# Altium project DST800_NMEA2k-CAN_Indicator.PrjPcb
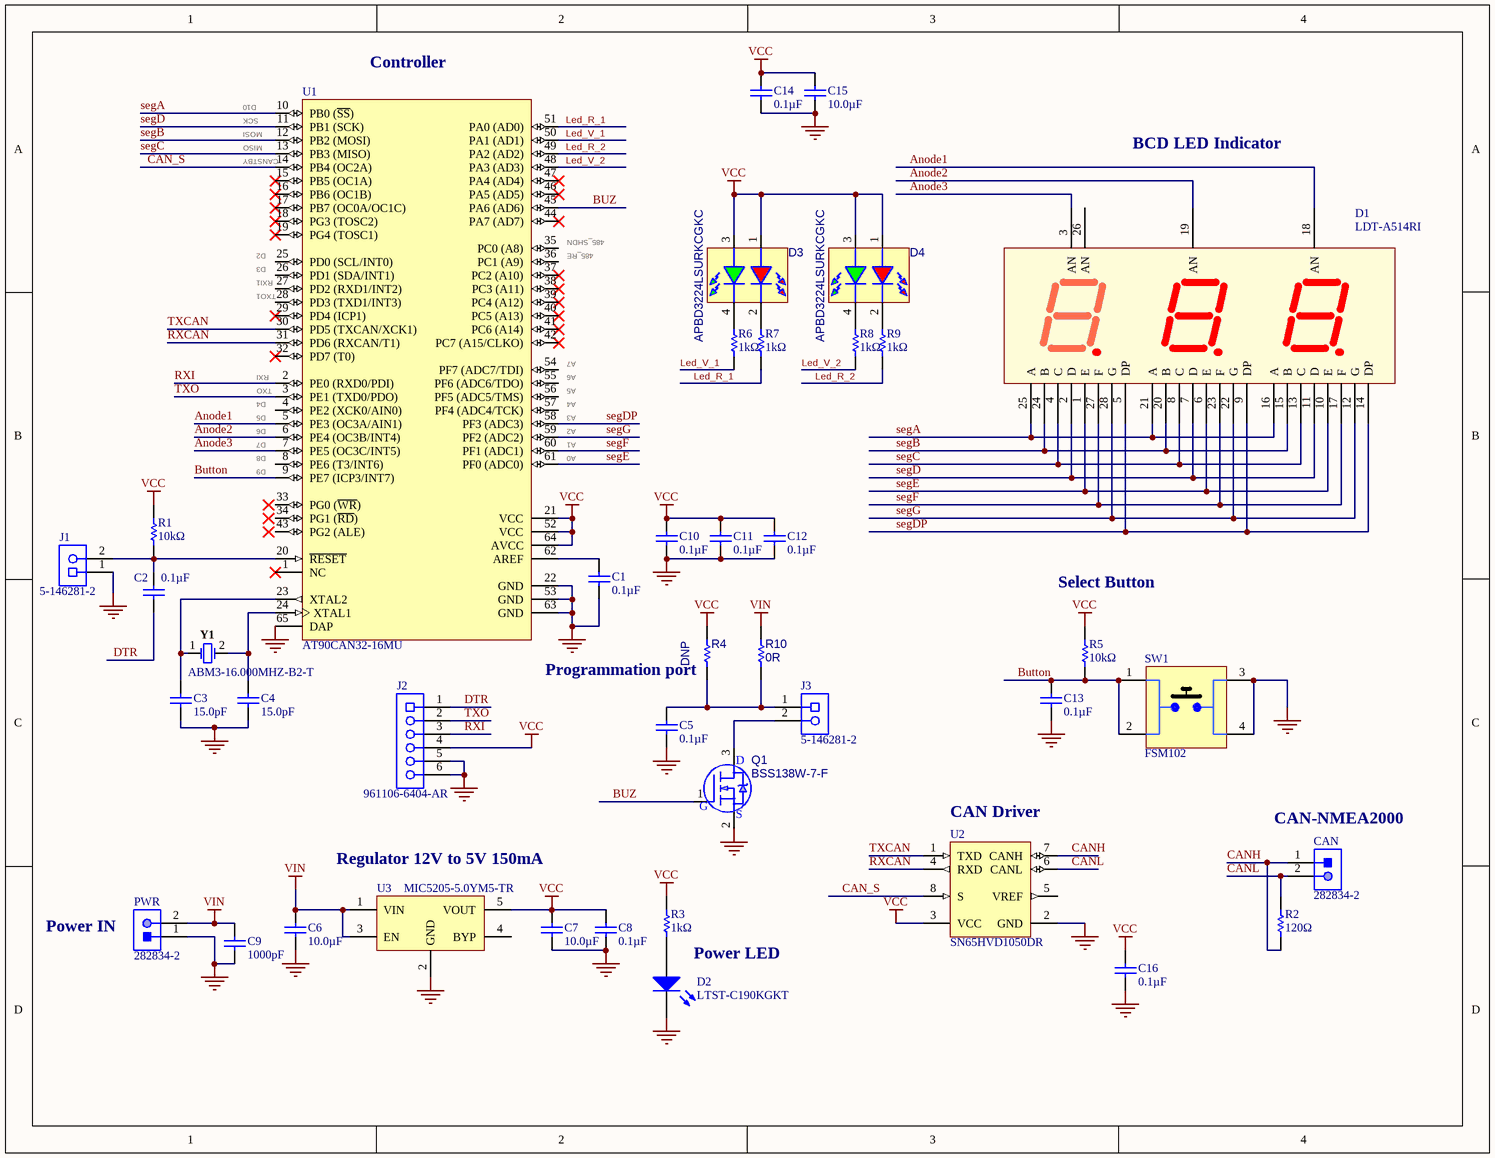
[diagram p0: DST800_NMEA2k-CAN_Indicator.SchDoc]
1 sheet, 41 parts. Net scope: global (net labels, ports and power ports of the same name join across sheets).
Board file: DST800_NMEA2k-CAN_Indicator.PcbDoc

## Sheet DST800_NMEA2k-CAN_Indicator.SchDoc: TITRE
size Letter; ApprovedBy: Approuvé par; CompanyName: Cégep de Limoilou; DrawnBy: Dessiné par; Organization: Cégep de Limoilou; DocumentNumber: Numéro schéma; Revision: Prel; SheetNumber: 1; SheetTotal: 1; CurrentDate: .date

### Parts
C1  value 0.1µF  [PCB-mhhqftc5ilnrg4qi8ds6-1]  (hidden comment: CL10B104KB8NNNC)
C2  value 0.1µF  [PCB-mhhqftc5ilnrg4qi8ds6-1]  (hidden comment: CL10B104KB8NNNC)
C3  value 15.0pF  [PCB-69ec8bfnjhyebnpbrrfx-1]  (hidden comment: C1608C0G1H150J080AA)
C4  value 15.0pF  [PCB-69ec8bfnjhyebnpbrrfx-1]  (hidden comment: C1608C0G1H150J080AA)
C5  value 0.1µF  [PCB-mhhqftc5ilnrg4qi8ds6-1]  (hidden comment: CL10B104KB8NNNC)
C6  value 10.0µF  [PCB-j0jk5xr8qbnaskonccg4-1]  (hidden comment: C3225X7R1E106K250AC)
C7  value 10.0µF  [PCB-j0jk5xr8qbnaskonccg4-1]  (hidden comment: C3225X7R1E106K250AC)
C8  value 0.1µF  [PCB-mhhqftc5ilnrg4qi8ds6-1]  (hidden comment: CL10B104KB8NNNC)
C9  value 1000pF  [CAPC1608X90X35LL15T15]  (hidden comment: 06031C102MAT2A)
C10  value 0.1µF  [PCB-mhhqftc5ilnrg4qi8ds6-1]  (hidden comment: CL10B104KB8NNNC)
C11  value 0.1µF  [PCB-mhhqftc5ilnrg4qi8ds6-1]  (hidden comment: CL10B104KB8NNNC)
C12  value 0.1µF  [PCB-mhhqftc5ilnrg4qi8ds6-1]  (hidden comment: CL10B104KB8NNNC)
C13  value 0.1µF  [PCB-mhhqftc5ilnrg4qi8ds6-1]  (hidden comment: CL10B104KB8NNNC)
C14  value 0.1µF  [PCB-mhhqftc5ilnrg4qi8ds6-1]  (hidden comment: CL10B104KB8NNNC)
C15  value 10.0µF  [PCB-j0jk5xr8qbnaskonccg4-1]  (hidden comment: C3225X7R1E106K250AC)
C16  value 0.1µF  [PCB-mhhqftc5ilnrg4qi8ds6-1]  (hidden comment: CL10B104KB8NNNC)
CAN  282834-2  [PCB-0kdx5sneyudsmu18l6zv-1]
D1  LDT-A514RI  [LDTA514RI]
D2  LTST-C190KGKT  [PCB-eapfwhp0rnksgujf96h3-1]
D3  APBD3224LSURKCGKC  [DS_LED_3224]
D4  APBD3224LSURKCGKC  [DS_LED_3224]
J1  5-146281-2  [PCB-angfy19quc8nc8nc7d0m-1]
J2  961106-6404-AR  [PCB-660833-1]
J3  5-146281-2  [PCB-angfy19quc8nc8nc7d0m-1]
PWR  282834-2  [PCB-0kdx5sneyudsmu18l6zv-1]
Q1  BSS138W-7-F  [SOT323-3N]
R1  value 10kΩ  [RESC1608X55X30NL15T15]  (hidden comment: CRG0603F10K)
R2  value 120Ω  [RESC3216X60X45LL10T20]  (hidden comment: CRCW1206120RJNEA)
R3  value 1kΩ  [RESC1608X55X30NL20T20]  (hidden comment: ERA-3AEB102V)
R4  DNP  [R_1005[0402]]  (no BOM)
R5  value 10kΩ  [RESC1608X55X30NL15T15]  (hidden comment: CRG0603F10K)
R6  value 1kΩ  [RESC1608X55X30NL20T20]  (hidden comment: ERA-3AEB102V)
R7  value 1kΩ  [RESC1608X55X30NL20T20]  (hidden comment: ERA-3AEB102V)
R8  value 1kΩ  [RESC1608X55X30NL20T20]  (hidden comment: ERA-3AEB102V)
R9  value 1kΩ  [RESC1608X55X30NL20T20]  (hidden comment: ERA-3AEB102V)
R10  value 0R  [R_1005[0402]]  (hidden comment: CRCW04020000Z0ED)
SW1  FSM102  [PCB-8ps4wla3pj92cxv2yuvu-1]
U1  AT90CAN32-16MU  [Z64-1_M]
U2  SN65HVD1050DR  [D0008A_L]
U3  MIC5205-5.0YM5-TR  [SOT-23-5_N]
Y1  ABM3-16.000MHZ-B2-T  [ABRA-ABM3_V]

### Nets
GND: C1.1 C3.1 C4.1 C5.1 C6.1 C7.1 C8.1 C9.1 C10.1 C11.1 C12.1 C13.1 C14.1 C15.1 C16.1 D2.2(K) J1.1 J2.5 J2.6 PWR.1 Q1.2(S) SW1.3 SW1.4 U1.22(GND) U1.53(GND) U1.63(GND) U1.65(DAP) U2.2(GND) U3.2(GND)
VCC: C7.2 C8.2 C10.2 C11.2 C12.2 C14.2 C15.2 C16.2 D3.1 D3.3 D4.1 D4.3 J2.4 R1.2 R3.2 R4.2 R5.2 U1.21(VCC) U1.52(VCC) U1.64(AVCC) U2.3(VCC) U3.5(VOUT)
VIN: C6.2 C9.2 PWR.2 R10.2 U3.1(VIN) U3.3(EN)
Anode1: D1.18(AN) U1.5(PE3_(OC3A/AIN1))
Anode2: D1.19(AN) U1.6(PE4_(OC3B/INT4))
Anode3: D1.3(AN) U1.7(PE5_(OC3C/INT5))
Button: C13.2 R5.1 SW1.1 SW1.2 U1.9(PE7_(ICP3/INT7))
BUZ: Q1.1(G) U1.45(PA6_(AD6))
CAN_S: U1.14(PB4_(OC2A)) U2.8(S)
CANH: CAN.1 R2.1 U2.7(CANH)
CANL: CAN.2 R2.2 U2.6(CANL)
DTR: C2.1 J2.1
Led_R_1: R7.2 U1.51(PA0_(AD0))
Led_R_2: R9.2 U1.49(PA2_(AD2))
Led_V_1: R6.2 U1.50(PA1_(AD1))
Led_V_2: R8.2 U1.48(PA3_(AD3))
RXCAN: U1.31(PD6_(RXCAN/T1)) U2.4(RXD)
RXI: J2.3 U1.2(PE0_(RXD0/PDI))
segA: D1.16(A) D1.21(A) D1.25(A) U1.10(PB0_(~{SS}))
segB: D1.15(B) D1.20(B) D1.24(B) U1.12(PB2_(MOSI))
segC: D1.4(C) D1.8(C) D1.13(C) U1.13(PB3_(MISO))
segD: D1.2(D) D1.7(D) D1.11(D) U1.11(PB1_(SCK))
segDP: D1.5(DP) D1.9(DP) D1.14(DP) U1.58(PF3_(ADC3))
segE: D1.1(E) D1.6(E) D1.10(E) U1.61(PF0_(ADC0))
segF: D1.17(F) D1.23(F) D1.27(F) U1.60(PF1_(ADC1))
segG: D1.12(G) D1.22(G) D1.28(G) U1.59(PF2_(ADC2))
TXCAN: U1.30(PD5_(TXCAN/XCK1)) U2.1(TXD)
TXO: J2.2 U1.3(PE1_(TXD0/PDO))
NetC1_2: C1.2 U1.62(AREF)
NetC2_2: C2.2 J1.2 R1.1 U1.20(~{RESET})
NetC3_2: C3.2 U1.23(XTAL2) Y1.1
NetC4_2: C4.2 U1.24(XTAL1) Y1.2
NetC5_2: C5.2 J3.1 R4.1 R10.1
NetD2_1: D2.1(A) R3.1
NetD3_2: D3.2 R7.1
NetD3_4: D3.4 R6.1
NetD4_2: D4.2 R9.1
NetD4_4: D4.4 R8.1
NetJ3_2: J3.2 Q1.3(D)

Not connected (* = marked no-connect by the designer): D1 26(AN); U1 1(NC)* 4(PE2_(XCK0/AIN0)) 8(PE6_(T3/INT6)) 15(PB5_(OC1A))* 16(PB6_(OC1B))* 17(PB7_(OC0A/OC1C))* 18(PG3_(TOSC2))* 19(PG4_(TOSC1))* 25(PD0_(SCL/INT0)) 26(PD1_(SDA/INT1)) 27(PD2_(RXD1/INT2)) 28(PD3_(TXD1/INT3)) 29(PD4_(ICP1))* 32(PD7_(T0))* 33(PG0_(~{WR})) 34(PG1_(~{RD})) 35(PC0_(A8)) 36(PC1_(A9)) 37(PC2_(A10))* 38(PC3_(A11))* 39(PC4_(A12))* 40(PC5_(A13))* 41(PC6_(A14))* 42(PC7_(A15/CLKO))* 43(PG2_(ALE)) 44(PA7_(AD7))* 46(PA5_(AD5))* 47(PA4_(AD4))* 54(PF7_(ADC7/TDI)) 55(PF6_(ADC6/TDO)) 56(PF5_(ADC5/TMS)) 57(PF4_(ADC4/TCK)); U2 5(VREF); U3 4(BYP)

### Notes on the sheet
- (near U1) Controller
- (near U1) D10
- (near U1) SCK
- (near U1) MOSI
- (near U1) MISO
- (near U1) CANSTBY
- BCD LED Indicator
- (near U1) D2
- (near U1) D3
- (near U1) RXI1
- (near U1) TXO1
- (near U1) 485_SHDN
- (near U1) 485_RE
- (near U1) A7
- (near U1) D4
- (near U1) D5
- (near U1) D6
- (near U1) RXI
- (near U1) TXO
- (near U1) A2
- (near U1) A3
- (near U1) A4
- (near U1) A5
- (near U1) A6
- (near U1) D7
- (near U1) D8
- (near U1) D9
- (near U1) A0
- (near U1) A1
- (near R5) Select Button
- Programmation port
- (near U2) CAN Driver
- (near CAN) CAN-NMEA2000
- Regulator 12V to 5V 150mA
- (near PWR) Power IN
- Power LED

### Library data of the parts
C1 C2 C5 C8 C10-C14 C16 = CMP-1af8d38ac64bc53f-5: CAP CER 0.1uF 50V X7R 0603; Manufacturer: Samsung Electro-Mechanics; Octopart URL: https://octopart.com/cl10b104kb8nnnc-samsung-7928277; OctopartID: 1af8d38ac64bc53f; Mounting Type: SMT; ManufacturerPartNumber: CL10B104KB8NNNC; Type: X7R; Supplier 1: Digi-Key; Supplier Part Number 1: 1276-1000-1-ND
C3 C4 = CMP-57259fa49f8088e2-2: CAP CER 15pF ±5% 50V C0G/NP0 0603 [1608]; Manufacturer: TDK; Octopart URL: https://octopart.com/c1608c0g1h150j080aa-tdk-25947587; OctopartID: 57259fa49f8088e2; ManufacturerPartNumber: C1608C0G1H150J080AA; Type: C0G/NP0; Mounting Type: SMT; Supplier 1: Digi-Key; Supplier Part Number 1: 445-1271-1-ND
C6 C7 C15 = CMP-2bdce35de069f41b-1: CAP CER 10uF ±10% 25V X7R 1210; Manufacturer: TDK; Case/Package: 1210; OctopartID: 2bdce35de069f41b; Octopart URL: http://octopart.com/c3225x7r1e106k250ac-tdk-25947859; ManufacturerPartNumber: C3225X7R1E106K250AC; Mounting Type: SMT; Type: X7R; Supplier 1: Digi-Key; Supplier Part Number 1: 445-3942-1-ND
C9 = CMP-126202-2: CAP CER 1000pF ±20% 100V X7R 0603; Manufacturer: AVX; Case/Package: 0603; Octopart Url: https://octopart.com/06031c102mat2a-avx+interconnect+%2F+elco-195738; OctopartID: 2b04e20cf2f8f4c3; ManufacturerPartNumber: 06031C102MAT2A; Tolerance: ±20%; Type: X7R; Mounting Type: SMT; Supplier 1: Digi-Key; Supplier Part Number 1: 478-3699-1-ND
CAN PWR = CMP-369bfdc835bbe95c-32: CONN Terminal Block; 16-30 AWG 0.197 in; Manufacturer: TE Connectivity; Octopart URL: https://octopart.com/282836-2-te+connectivity-39396934; ManufacturerPartNumber: 282834-2; Mounting Type: TH; Supplier 1: Digi-Key; Supplier Part Number 1: A98333-ND
D1 = CMP-6dbba4b18441b27c-1: Display 3-digit 7-Seg 0.56 in; Manufacturer: Lumex; Octopart URL: http://octopart.com/ldt-a514ri-lumex-52380; Case/Package: DIP; OctopartID: 6dbba4b18441b27c; ManufacturerPartNumber: LDT-A514RI; Mounting Type: TH; Supplier 1: Digi-Key; Supplier Part Number 1: 67-1423-ND
D2 = CMP-e1642866a00b3ea3-3: LED 0603 green; Manufacturer: Lite-On; Octopart URL: http://octopart.com/ltst-c190kgkt-lite-on-549897; OctopartID: e1642866a00b3ea3; Case/Package: 0603; ManufacturerPartNumber: LTST-C190KGKT; Mounting Type: SMT; Supplier 1: Digi-Key; Supplier Part Number 1: 160-1435-1-ND
D3 D4 = D_LED_RED_Y-GREEN_3224: LED Red and Yellow-Green; Manufacturer: Kingbright; Value: Red - Yellow-Green; RoHS: Yes; Manufacturer_PN: APBD3224LSURKCGKC; Technology: SMT; Supplier 1: Digi-Key; Supplier Part Number 1: 754-1962-1-ND
J1 J3 = CMP-39c9f206a0b6e60e-14: CONN HEADER VERT 2POS Single 0.1in pitch; Manufacturer: TE Connectivity; OctopartID: 39c9f206a0b6e60e; ManufacturerPartNumber: 5-146281-2; Mounting Type: TH; Supplier 1: Digi-Key; Supplier Part Number 1: A121481-ND
J2 = CMP-660833-2: CONN HEADER VERT 6POS Single 0.1in pitch; Manufacturer: 3M; Octopart Url: https://octopart.com/961106-6404-ar-3m-14400736; OctopartID: f2bb3b6a6b3d2d7c; ManufacturerPartNumber: 961106-6404-AR; Mounting Type: TH; Supplier 1: Digi-Key; Supplier Part Number 1: 3M9457-06-ND
Q1 = Q_BSS138W: NMOS 200mA; Manufacturer: Diodes inc; RoHS: Yes; Value: BSS138W; Manufacturer_PN: BSS138W-7-F; Supplier 1: Digi-Key; Supplier Part Number 1: BSS138W-FDICT-ND; Technology: SMT
R1 R5 = CMP-584891b72cc4878f-2: RES 10K 1% 0.1W 0603; Manufacturer: TE Connectivity; Case/Package: 0603; Octopart URL: http://octopart.com/crg0603f10k-te+connectivity-16077290; OctopartID: 584891b72cc4878f; Power Rating: 0.1 W; ManufacturerPartNumber: CRG0603F10K; Mounting Type: SMT; Supplier 1: Digi-Key; Supplier Part Number 1: A106048CT-ND
R2 = CMP-1858100-4: RES Thick Film 120ohm 5% 1/4W 1206; Manufacturer: Vishay; Power Rating: 0.25 W; Octopart Url: https://octopart.com/crcw1206120rjnea-vishay+dale-39437323; Case/Package: 1206[3216]; OctopartID: 57d69c85b6bb8811; ManufacturerPartNumber: CRCW1206120RJNEA; Mounting Type: SMT; Tolerance: ±5%; Type: Thick; Supplier 1: Digi-Key; Supplier Part Number 1: 541-120ECT-ND
R3 R6-R9 = CMP-3717598-2: RES Metal Film 1Kohm 0.1%  0603; Manufacturer: Panasonic; Power Rating: 0.063 W; Octopart Url: https://octopart.com/era-3yeb102v-panasonic-55477313; OctopartID: 4ba281e6ea859465; ManufacturerPartNumber: ERA-3AEB102V; Mounting Type: SMT; Tolerance: ±0.1%; Type: Metal; Supplier 1: Digi-Key; Supplier Part Number 1: P1.0KYCT-ND
R4 = R_0R_0,0625W_0402: Chip Resistor; Manufacturer: Vishay-Dale; Manufacturer_PN: CRCW04020000Z0ED; Tolerance: jumper; Working Voltage: 50V; Power: 1/16W; Value: 0R; RoHS: Yes; Technology: SMT; Supplier 1: Digi-Key; Supplier Part Number 1: 541-0.0JCT-ND
R10 = R_0R_0,0625W_0402: Chip Resistor; Manufacturer: Vishay-Dale; Tolerance: jumper; Working Voltage: 50V; Power: 1/16W; Manufacturer_PN: CRCW04020000Z0ED; RoHS: Yes; Technology: SMT; Supplier 1: Digi-Key; Supplier Part Number 1: 541-0.0JCT-ND
SW1 = CMP-43e488b0e8c29c23-11: PUSHBUTTON Momentary Tactile SPST Thru-Hole; Manufacturer: TE Connectivity; OctopartID: 43e488b0e8c29c23; ManufacturerPartNumber: FSM102; Mounting Type: TH; Supplier 1: Digi-Key; Supplier Part Number 1: 450-1128-ND
U1 = CMP-0096-00069-2: 8-bit AVR Microcontroller, 32KB Flash and CAN Controller, 53 GPIO pins, Industrial Grade (-40° to +85°C), 64-pin VQFN, Green; PackageDescription: 64-Pin Quad Flat No-Lead, 9 x 9 mm Body, 0.5 mm Pitch, 5.4 x 5.4 mm Exposed Pad; Code_JEDEC: MO-220VMMD-3; ComponentLink3URL: http://www.atmel.com/dyn/resources/prod_documents/7679S.pdf; ComponentLink1URL: http://www.atmel.com/; RevisionNote: URLs added; ComponentLink1Description: Manufacturer URL; PackageVersion: 2008; ComponentLink2URL: http://www.atmel.com/dyn/resources/prod_documents/doc7679.pdf; ComponentLink2Description: AT90CAN32/64/128 Datasheet; PackageReference: Z64-1; ComponentLink3Description: AT90CAN32/64/128 Summary; DatasheetVersion: revH, Aug-2008
U2 = CMP-0315-00053-2: High-Speed EMC Optimized CAN Transceiver, 70 mA, 5 V, -40 to 125 degC, 8-pin SOIC (D), Green (RoHS & no Sb/Br); Manufacturer: Texas Instruments; Rating: Catalog; Transient Pulse Protection(V): -200 to 200; Supply Voltage(s)(V): 5; Bus Fault Voltage(V): -4 to 16; ICC(Max)(mA): 70; Drivers Per Package: 1; PackageVersion: revM, Jun-2011; ComponentLink1Description: Datasheet; Code_JEDEC: MS-012AA; DatasheetVersion: SLLS632B; ComponentLink1URL: http://www.ti.com/general/docs/lit/getliterature.tsp?genericPartNumber=SN65HVD1050&fileType=pdf; Isolated: No; Eco-Plan: Green (RoHS & no Sb/Br); PackageReference: D0008A; SubFamily: CAN; Footprint: TJA1050; Mounting Technology: Surface Mount; PackageDescription: 8-Pin Plastic Small Outline Integrated Circuit, 4.9 x 3.9 mm, Pitch 1.27 mm Pitch; PartNumber: SN65HVD1050DR; Receivers Per Package: 1
U3 = CMP-6255a8a416e5bd92-5: IC Regulator LDO 5 V Fixed Output 150 mA SOT-23-5; Manufacturer: Microchip; Octopart URL: https://octopart.com/mic5205-5.0ym5-tr-microchip-66802134; ManufacturerPartNumber: MIC5205-5.0YM5-TR; Mounting Type: SMT; Supplier 1: Digi-Key; Supplier Part Number 1: 576-1261-1-ND
Y1 = CMP-2000-05729-1: Ceramic Crystal, 16 MHz, 2-Pin SMD; Manufacturer: ABRACON; Case Height: 1.3mm; Frequency: 16MHz; Case Width: 3.2mm; Case Length: 5mm; Packaging: Reel; Package Description: 2-Pin Surface Mount Device, Body 5 x 3.2 mm; Manufacturer URL: http://www.abracon.com/; Mounting Technology: SurfaceMount; RoHS: Details; Operating Temperature Range: -20Cto+70C; Datasheet URL: http://www.abracon.com/Resonators/abm3.pdf; Type: MiniatureCeramicCrystal; Series: ABM3; Product Category: Crystals; Factory Pack Quantity: 1000; Mounting Style: SMD/SMT; Brand: ABRACON; Datasheet Version: 09/2013; Dimensions: 3.2mmWx5mmLx1.3mmH; Termination Style: SMD/SMT; Package Reference: ABM3; Package / Case: 5mmx3.2mm; ManufacturerPartNumber: ABM3-16.000MHZ-B2-T